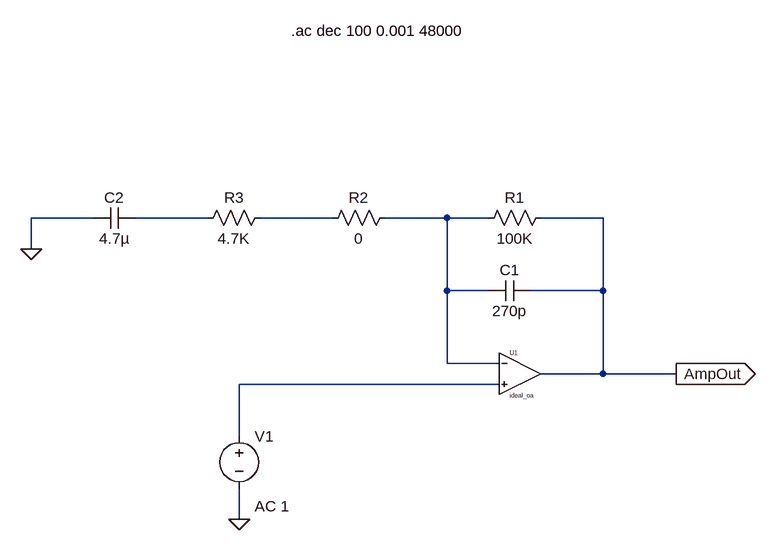
[diagram p0: schematic pre_amplificador_gabriel_mendes.asc]
pre_amplificador_gabriel_mendes.asc, the LTspice schematic file:
Version 4
SHEET 1 880 1156
WIRE -336 -720 -432 -720
WIRE -160 -720 -272 -720
WIRE 32 -720 -80 -720
WIRE 208 -720 112 -720
WIRE 272 -720 208 -720
WIRE 448 -720 352 -720
WIRE -432 -672 -432 -720
WIRE 208 -608 208 -720
WIRE 272 -608 208 -608
WIRE 448 -608 448 -720
WIRE 448 -608 336 -608
WIRE 208 -496 208 -608
WIRE 288 -496 208 -496
WIRE 448 -480 448 -608
WIRE 448 -480 352 -480
WIRE 560 -480 448 -480
WIRE 288 -464 -112 -464
WIRE -112 -384 -112 -464
WIRE -112 -256 -112 -304
FLAG -112 -256 0
FLAG 560 -480 AmpOut
IOPIN 560 -480 Out
FLAG -432 -672 0
SYMBOL voltage -112 -400 R0
WINDOW 123 24 124 Left 2
WINDOW 39 0 0 Left 0
SYMATTR Value2 AC 1
SYMATTR InstName V1
SYMATTR Value ""
SYMBOL ideal_oa 304 -480 R0
SYMATTR InstName U1
SYMBOL cap 272 -592 R270
WINDOW 0 32 32 VTop 2
WINDOW 3 0 32 VBottom 2
SYMATTR InstName C1
SYMATTR Value 270p
SYMBOL res 368 -736 R90
WINDOW 0 0 56 VBottom 2
WINDOW 3 32 56 VTop 2
SYMATTR InstName R1
SYMATTR Value 100K
SYMBOL res 128 -736 R90
WINDOW 0 0 56 VBottom 2
WINDOW 3 32 56 VTop 2
SYMATTR InstName R2
SYMATTR Value 0
SYMBOL res -64 -736 R90
WINDOW 0 0 56 VBottom 2
WINDOW 3 32 56 VTop 2
SYMATTR InstName R3
SYMATTR Value 4.7K
SYMBOL cap -336 -704 R270
WINDOW 0 32 32 VTop 2
WINDOW 3 0 32 VBottom 2
SYMATTR InstName C2
SYMATTR Value 4.7µ
TEXT -32 -1008 Left 2 !.ac dec 100 0.001 48000

The netlist it stands for:
* pre_amplificador_gabriel_mendes.asc
V1 N004 0 AC 1
XU1 N004 N003 AmpOut ideal_oa Rin=1e9, Rout=1, A=1e9  ; pins p m out
C1 N003 AmpOut 270p
R1 AmpOut N003 100K
R2 N003 N002 0
R3 N002 N001 4.7K
C2 0 N001 4.7µ
.ac dec 100 0.001 48000
.lib ece412.lib
.backanno
.end